# EasyEDA schematic Led_Driver_Flashlight.json
TITLE: Led Driver for flashlight solar cell; REV: 1.0; Date: 2024-05-19; Sheet: 1/1; Drawn By: AmirB; Company: Your Company
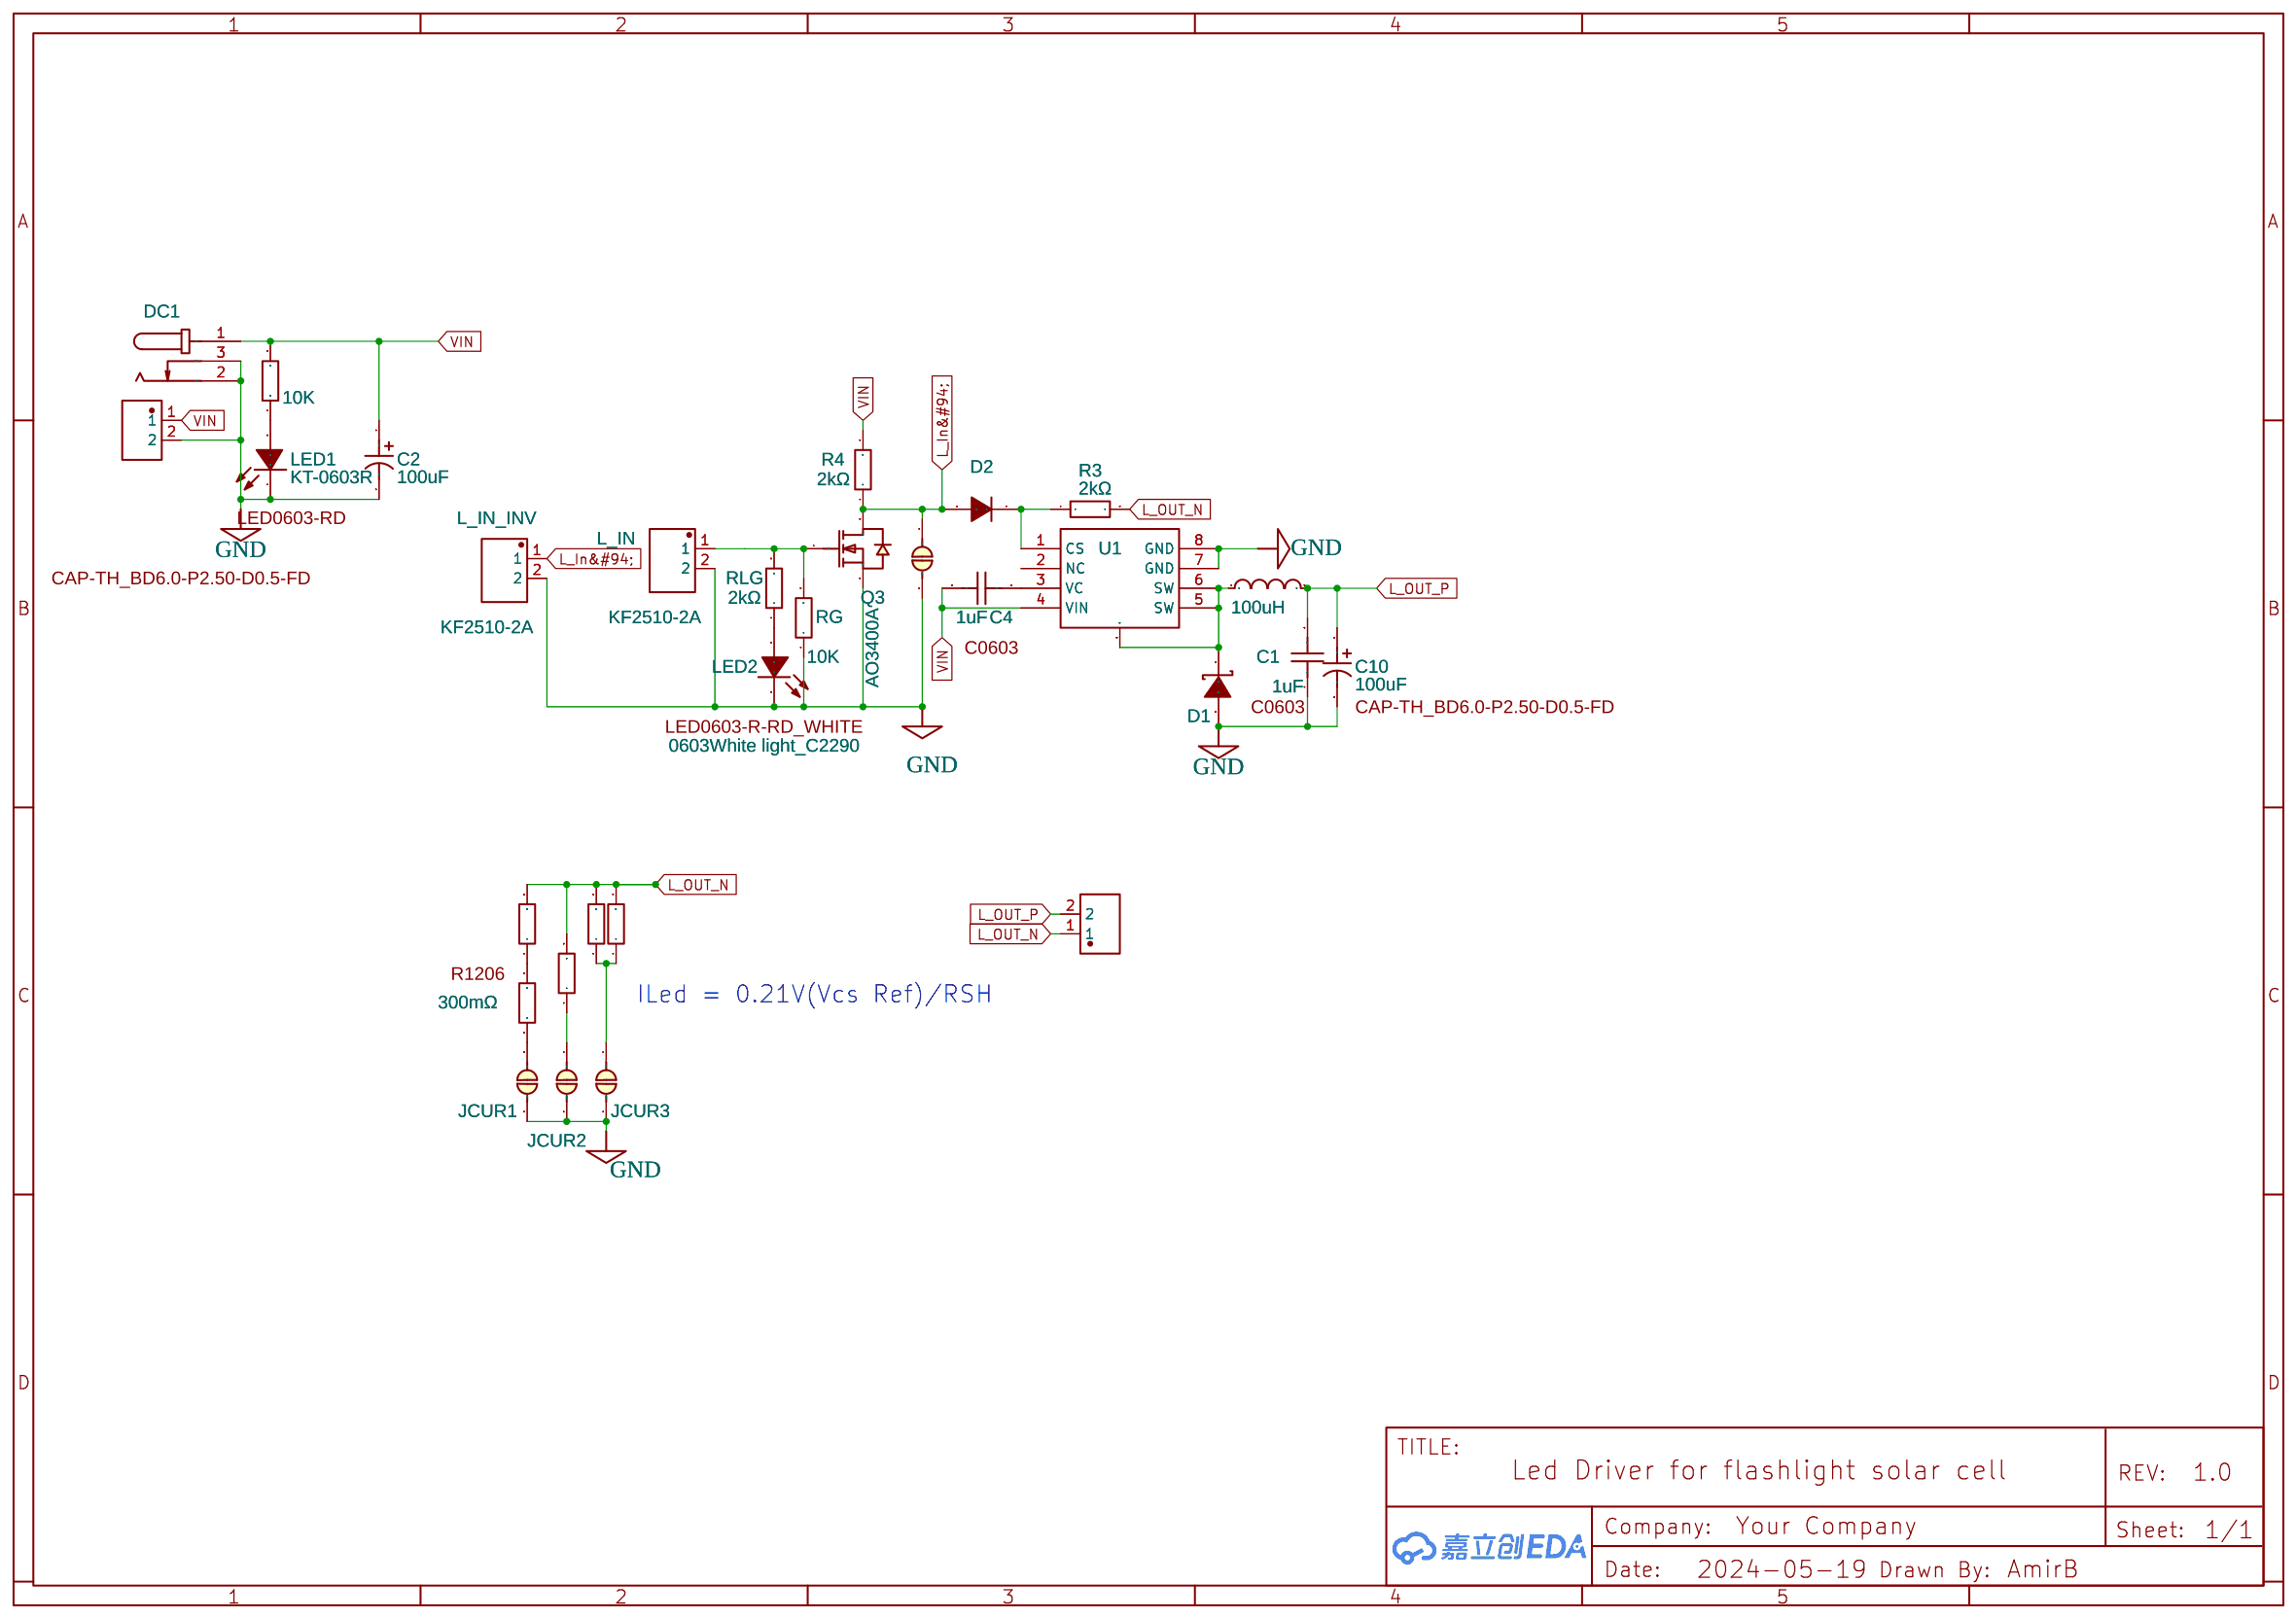
[diagram p0: schematic sheet]

## Parts
C1  1uF  [C0603]
C2  100uF  [CAP-TH_BD6.0-P2.50-D0.5-FD]
C4  1uF  [C0603]
C10  100uF  [CAP-TH_BD6.0-P2.50-D0.5-FD]
CN_L  MX126-5.0-GN01-02P-CU-S-A  [CONN-TH_2P-P5.00_MX126-5.0-GN01-02P-CU-S-A]
CNVIN  MX126-5.0-GN01-02P-CU-S-A  [CONN-TH_2P-P5.00_MX126-5.0-GN01-02P-CU-S-A]
D1  B540C-13-F  [SMC_L7.1-W6.2-LS8.1-RD]
D2  1N4148WS T4  [SOD-323_L1.8-W1.3-LS2.5-RD]
DC1  DC005-2.0MM  [DC-IN-TH_DC005-T20]
JCUR1  JUMPER-VLDO  [JUMPERS_SMT-JUMPER_2_NC_PASTE_NO-SILK]
JCUR2  JUMPER-VLDO  [JUMPERS_SMT-JUMPER_2_NC_PASTE_NO-SILK]
JCUR3  JUMPER-VLDO  [JUMPERS_SMT-JUMPER_2_NC_PASTE_NO-SILK]
JON  JUMPER-VLDO  [JUMPERS_SMT-JUMPER_2_NC_PASTE_NO-SILK]
L1  100uH  [IND-SMD_L13.4-W12.6]
L_IN  KF2510-2A  [CONN-TH_KF2510-2A]
L_IN_INV  KF2510-2A  [CONN-TH_KF2510-2A]
LED1  KT-0603R  [LED0603-RD]
LED2  0603White light_C2290  [LED0603-R-RD_WHITE]
Q3  AO3400A  [SOT-23-3_L2.9-W1.6-P1.90-LS2.8-BR]
R3  2kΩ  [R0603]
R4  2kΩ  [R0603]
RG  10K  [R0603]
RL1  10K  [R0603]
RLG  2kΩ  [R0603]
RS1  300mΩ  [R1206]
RS2  300mΩ  [R1206]
RS3  300mΩ  [R1206]
RS4  300mΩ  [R1206]
RS5  300mΩ  [R1206]
U1  -  [SOIC-8_L4.9-W3.9-P1.27-LS6.0-BL-EP3.3]

## Library data of the parts
C1 C4 = CL10A105KB8NNNC: Supplier: LCSC; Manufacturer: SAMSUNG(三星); Supplier Part: C15849; JLCPCB Part Class: Basic Part; Package Display: Yes
C2 C10 = 03EC0673: Supplier: LCSC; Supplier Part: C2831717; Manufacturer: KNSCHA(科尼盛); JLCPCB Part Class: Extended Part; Contributor: lcsc; Package Display: Yes
CN_L CNVIN = MX126-5.0-GN01-02P-CU-S-A: Supplier: LCSC; Supplier Part: C5188434; Manufacturer: MAX(迈旭); JLCPCB Part Class: Extended Part; Contributor: lcsc; Package Display: No
D1 = B540C-13-F: Supplier: LCSC; Manufacturer: DIODES(美台); Supplier Part: C72264; JLCPCB Part Class: Extended Part; Package Display: No
D2 = 1N4148WS T4: Supplier: LCSC; Manufacturer: CJ(江苏长电/长晶); Supplier Part: C2128; JLCPCB Part Class: Basic Part; Package Display: No
DC1 = DC005-2.0MM: Supplier: LCSC; Manufacturer: SOFNG(硕方); Supplier Part: C111567; JLCPCB Part Class: Extended Part; Package Display: No
JCUR1-JCUR3 JON = JUMPER-SMT_2: Contributor: P-Thomsen; Package Display: No
L1 = MWSA1206S-101MT: Contributor: LCSC; Supplier: LCSC; Supplier Part: C408533; Manufacturer: Sunlord(顺络); JLCPCB Part Class: Extended Part; Package Display: No
L_IN L_IN_INV = KF2510-2A: Supplier: LCSC; Manufacturer: BOOMELE; Supplier Part: C27543; JLCPCB Part Class: Extended Part; Package Display: No
LED1 = KT-0603R: Supplier: LCSC; Manufacturer: KENTO; Supplier Part: C2286; JLCPCB Part Class: Basic Part; Package Display: Yes
LED2 = 0603White light_C2290: Supplier: LCSC; Manufacturer: KENTO; Supplier Part: C2290; JLCPCB Part Class: Basic Part; Package Display: Yes
Q3 = AO3400A: Supplier: LCSC; Manufacturer: AOS; Supplier Part: C20917; JLCPCB Part Class: Basic Part; Package Display: No
R3 R4 RLG = 0603WAF2001T5E: Supplier: LCSC; Manufacturer: UNI-ROYAL(厚声); Supplier Part: C22975; JLCPCB Part Class: Basic Part; Package Display: No
RG RL1 = 0603WAF1001T5E: Supplier: LCSC; Manufacturer: UniOhm; Manufacturer Part: 0603WAF1002T5E; Supplier Part: C25804; JLCPCB Part Class: Basic Part; Package Display: No
RS1 RS3-RS5 = 1206W4F300LT5E: Supplier: LCSC; Manufacturer: UNI-ROYAL(厚声); Supplier Part: C59882; JLCPCB Part Class: Extended Part; Package Display: No
RS2 = 1206W4F300LT5E: Supplier: LCSC; Manufacturer: UNI-ROYAL(厚声); Supplier Part: C59882; JLCPCB Part Class: Extended Part; Package Display: Yes
U1 = XL3001E1: Supplier: LCSC; Manufacturer: XLSEMI(芯龙); Supplier Part: C73020; JLCPCB Part Class: Extended Part; Package Display: No

## Nets
GND: C1.1 C2.2 C10.2 CNVIN.2 D1.2(A) DC1.2 DC1.3 JCUR1.2 JCUR2.2 JCUR3.2 JON.2 L_IN.2 L_IN_INV.2 LED1.1(K) LED2.2(K) Q3.2(S) RG.1 U1.7(GND) U1.8(GND)
VIN: C2.1 C4.1 CNVIN.1 DC1.1 R4.2 RL1.2 U1.4(VIN)
L_In&#94;: D2.2(A) JON.1 L_IN_INV.1 Q3.3(D) R4.1
L_OUT_N: CN_L.1 R3.2 RS1.2 RS3.2 RS4.2 RS5.2
L_OUT_P: C1.2 C10.1 CN_L.2 L1.2
Net-(C4-2): C4.2 U1.3(VC)
Net-(D1-1): D1.1(K) L1.1 U1.5(SW) U1.6(SW) U1.9
Net-(D2-1): D2.1(K) R3.1 U1.1(CS)
Net-(JCUR1-1): JCUR1.1 RS2.1
Net-(JCUR2-1): JCUR2.1 RS3.1
Net-(JCUR3-1): JCUR3.1 RS4.1 RS5.1
Net-(L_IN-1): L_IN.1 Q3.1(G) RG.2 RLG.2
Net-(LED1-2): LED1.2(A) RL1.1
Net-(LED2-1): LED2.1(A) RLG.1
Net-(RS1-1): RS1.1 RS2.2

Not connected (* = marked no-connect by the designer): U1 2(NC)

## Notes on the sheet
- ILed = 0.21V(Vcs Ref)/RSH
